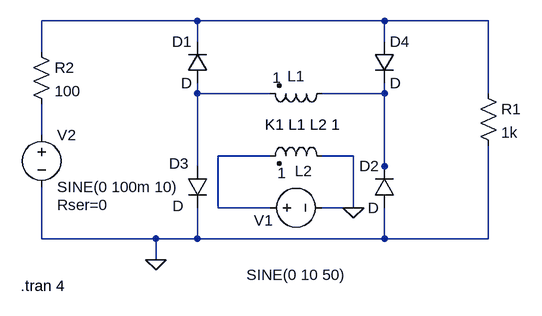
[diagram p0: schematic ponte_di _Cowan.asc]
ponte_di _Cowan.asc, the LTspice schematic file:
Version 4
SHEET 1 1024 680
WIRE 96 16 -144 16
WIRE 384 16 96 16
WIRE 544 16 384 16
WIRE 96 48 96 16
WIRE 384 48 384 16
WIRE -144 64 -144 16
WIRE 96 128 96 112
WIRE 208 128 96 128
WIRE 384 128 384 112
WIRE 384 128 288 128
WIRE 544 128 544 16
WIRE -144 192 -144 144
WIRE 208 224 128 224
WIRE 336 224 288 224
WIRE 96 240 96 128
WIRE 384 240 384 128
WIRE 384 256 384 240
WIRE 128 304 128 224
WIRE 208 304 128 304
WIRE 336 304 336 224
WIRE 336 304 288 304
WIRE -144 352 -144 272
WIRE 32 352 -144 352
WIRE 96 352 96 304
WIRE 96 352 32 352
WIRE 384 352 384 304
WIRE 384 352 96 352
WIRE 544 352 544 208
WIRE 544 352 384 352
WIRE 32 384 32 352
FLAG 32 384 0
FLAG 336 304 0
SYMBOL diode 112 112 R180
WINDOW 0 24 64 Left 2
WINDOW 3 24 0 Left 2
SYMATTR InstName D1
SYMBOL diode 400 304 R180
WINDOW 0 24 64 Left 2
WINDOW 3 24 0 Left 2
SYMATTR InstName D2
SYMBOL diode 80 240 R0
WINDOW 0 -28 -4 Left 2
WINDOW 3 -22 61 Left 2
SYMATTR InstName D3
SYMBOL diode 368 48 R0
SYMATTR InstName D4
SYMBOL ind2 304 112 R90
WINDOW 0 5 56 VBottom 2
WINDOW 3 -24 86 VTop 2
SYMATTR InstName L1
SYMATTR Value 1
SYMATTR Type ind
SYMBOL ind2 304 240 M270
WINDOW 0 -23 44 VTop 2
WINDOW 3 5 78 VBottom 2
SYMATTR InstName L2
SYMATTR Value 1
SYMATTR Type ind
SYMBOL voltage 192 304 R270
WINDOW 0 -35 6 VTop 2
WINDOW 3 -88 56 VBottom 2
WINDOW 123 0 0 Left 2
SYMATTR InstName V1
SYMATTR Value SINE(0 10 50)
SYMATTR SpiceLine Rser=100
SYMBOL voltage -144 176 R0
WINDOW 123 0 0 Left 2
WINDOW 39 24 124 Left 2
SYMATTR SpiceLine Rser=0
SYMATTR InstName V2
SYMATTR Value SINE(0 100m 10)
SYMBOL res 528 112 R0
SYMATTR InstName R1
SYMATTR Value 1k
SYMBOL res -160 48 R0
SYMATTR InstName R2
SYMATTR Value 100
TEXT 200 176 Left 2 !K1 L1 L2 1
TEXT -176 424 Left 2 !.tran 4

The netlist it stands for:
* ponte_di _Cowan.asc
D1 N002 N001 D
D2 0 N003 D
D3 N002 0 D
D4 N001 N003 D
L1 N003 N002 1
L2 0 N005 1
V1 N005 0 SINE(0 10 50) Rser=100
V2 N004 0 SINE(0 100m 10) Rser=0
R1 N001 0 1k
R2 N001 N004 100
.model D D
.lib standard.dio
K1 L1 L2 1
.tran 4
.backanno
.end